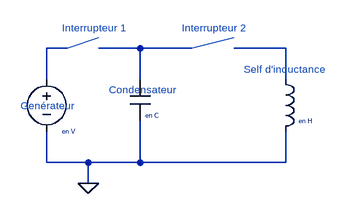
[diagram p0: schematic Draft1.asc]
Draft1.asc, the LTspice schematic file:
Version 4.1
SHEET 1 880 680
WIRE 16 64 -16 64
WIRE 128 64 64 64
WIRE 208 64 128 64
WIRE 352 64 272 64
WIRE -16 112 -16 64
WIRE 128 112 128 64
WIRE 352 112 352 64
WIRE -16 240 -16 192
WIRE 48 240 -16 240
WIRE 128 240 128 176
WIRE 128 240 48 240
WIRE 352 240 352 192
WIRE 352 240 128 240
WIRE 48 272 48 240
FLAG 48 272 0
SYMBOL cap 112 112 R0
WINDOW 0 24 8 Invisible 1
WINDOW 3 24 56 Left 0
SYMATTR InstName Condensateur
SYMATTR Value en C
SYMBOL ind 336 96 R0
WINDOW 0 36 40 Invisible 2
WINDOW 3 36 80 Left 0
SYMATTR InstName L1
SYMATTR Value en H
SYMATTR SpiceLine Rser=1m
SYMBOL voltage -16 96 R0
WINDOW 0 133 16 Invisible 1
WINDOW 3 24 96 Left 0
SYMATTR InstName Generateur
SYMATTR Value en V
TEXT -56 152 Left 1 ;Genérateur
TEXT 80 128 Left 1 ;Condensateur
TEXT 288 96 Left 1 ;Self d'inductance
TEXT 8 32 Left 1 ;Interrupteur 1
TEXT 192 32 Left 1 ;Interrupteur 2
LINE Normal 64 48 16 64
LINE Normal 272 48 208 64

The netlist it stands for:
* Draft1.asc
Condensateur N002 0 en C
L1 N003 0 en H Rser=1m
V§Generateur N001 0 en V
* Genérateur
* Condensateur
* Self d'inductance
* Interrupteur 1
* Interrupteur 2
.backanno
.end